# Altium schematic sheet mcu-misc.SchDoc
size A3; DocumentNumber: 26; SheetNumber: 26; SheetTotal: 45; SheetDescription: MCU Clock, JTAG, Error and Reset
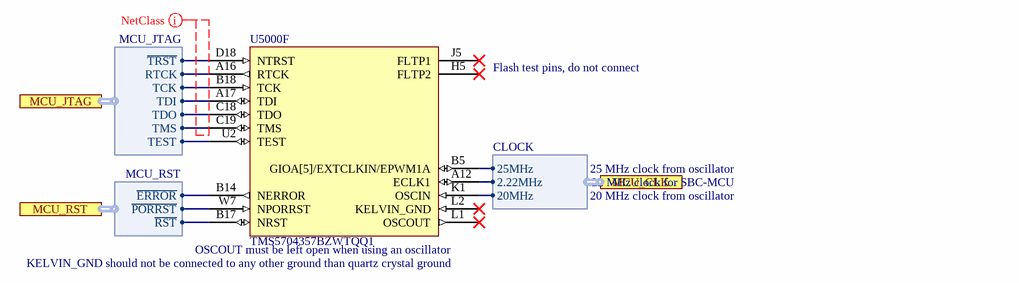
[diagram p0: mcu-misc.SchDoc]

## Parts
U5000  TMS5704357BZWTQQ1  [BGA337C80P19X19_1600X1600X140]  (part F of 6)

## Ports
MCU_CLK (harness CLOCK), MCU_JTAG (harness MCU_JTAG), MCU_RST (harness MCU_RST)

## Harnesses
MCU_JTAG: ~{TRST}, RTCK, TCK, TDI, TDO, TMS, TEST
CLOCK: 2.22MHz, 20MHz, 25MHz
MCU_RST: ~{ERROR}, ~{PORRST}, ~{RST}

## Nets
NetU5000_A12: U5000.A12(ECLK1) ; port MCU_CLK.2.22MHz
NetU5000_A16: U5000.A16(RTCK) ; port MCU_JTAG.RTCK
NetU5000_A17: U5000.A17(TDI) ; port MCU_JTAG.TDI
NetU5000_B5: U5000.B5(GIOA[5]/EXTCLKIN/EPWM1A) ; port MCU_CLK.25MHz
NetU5000_B14: U5000.B14(NERROR) ; port MCU_RST.~{ERROR}
NetU5000_B17: U5000.B17(NRST) ; port MCU_RST.~{RST}
NetU5000_B18: U5000.B18(TCK) ; port MCU_JTAG.TCK
NetU5000_C18: U5000.C18(TDO) ; port MCU_JTAG.TDO
NetU5000_C19: U5000.C19(TMS) ; port MCU_JTAG.TMS
NetU5000_D18: U5000.D18(NTRST) ; port MCU_JTAG.~{TRST}
NetU5000_K1: U5000.K1(OSCIN) ; port MCU_CLK.20MHz
NetU5000_U2: U5000.U2(TEST) ; port MCU_JTAG.TEST
NetU5000_W7: U5000.W7(NPORRST) ; port MCU_RST.~{PORRST}

Not connected (* = marked no-connect by the designer): U5000 H5(FLTP2)* J5(FLTP1)* L1(OSCOUT)* L2(KELVIN_GND)*

## Layout directives
net class MCU_JTAG: (no net found under the mark)

## Notes on the sheet
- Flash test pins, do not connect
- EXTCLKIN: 25 MHz clock from oscillator
- ECLK1: 2.22 MHz clock for SBC-MCU
- OSCIN: 20 MHz clock from oscillator
- (near U5000) KELVIN_GND should not be connected to any other ground than quartz crystal ground
- (near U5000) OSCOUT must be left open when using an oscillator
- Fraunhofer IISB
- Schottkystr. 10
- developed by:
- 91058 Erlangen
- Germany
- Author
- Project
- License
- Description
- File
- Version
- Release Date
- Sheet
- foxbms.org <https://foxbms.org>
- www.iisb.fraunhofer.de <https://www.iisb.fraunhofer.de/>
- foxBMS Team
- /